# Altium schematic sheet interfaces_module.SchDoc
size A4
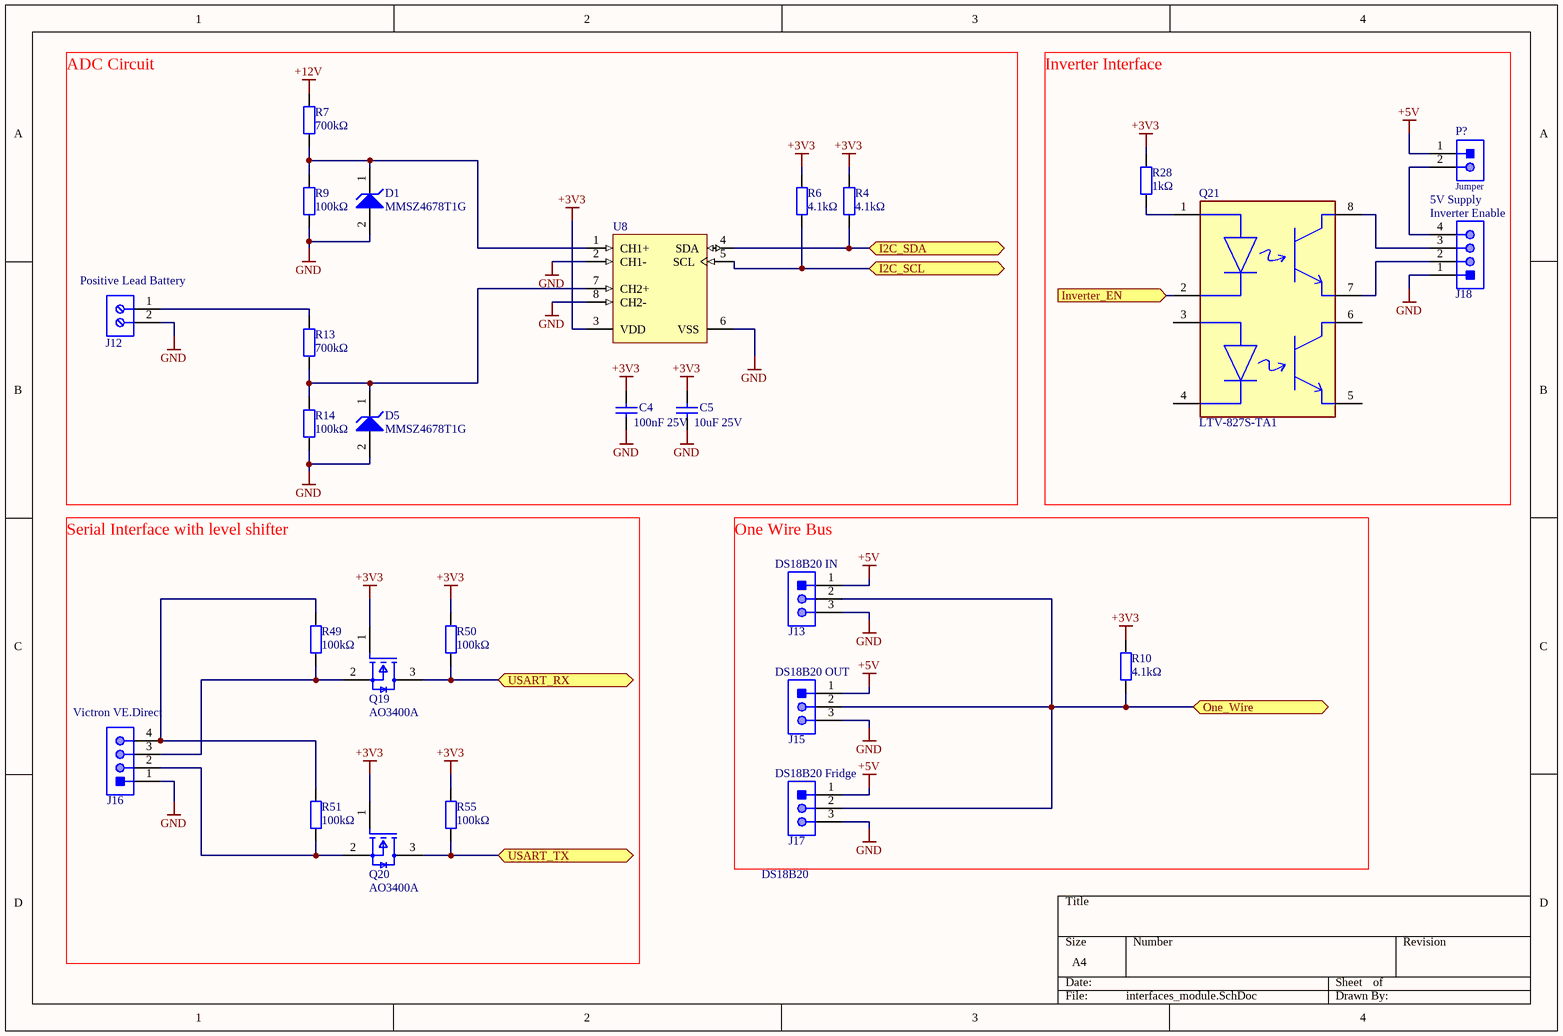
[diagram p0: interfaces_module.SchDoc]

## Parts
C4  100nF 25V  [CAPC2013X88X50ML20T25]
C5  10uF 25V  [CAPC2013X88X50ML20T25]
D1  MMSZ4678T1G  [ONSC-SOD-123-2-425-04_V]
D5  MMSZ4678T1G  [ONSC-SOD-123-2-425-04_V]
J12  282836-2  [TECO-282836-2_V]  (value not drawn)
J13  JST-S3B-PH-SM4-TB-3_V  [JST-S3B-PH-SM4-TB-3_V]  (value not drawn)
J15  JST-S3B-PH-SM4-TB-3_V  [JST-S3B-PH-SM4-TB-3_V]  (value not drawn)
J16  JST-S4B-PH-SM4-TB-3_V  [JST-S4B-PH-SM4-TB-3_V]  (value not drawn)
J17  JST-S3B-PH-SM4-TB-3_V  [JST-S3B-PH-SM4-TB-3_V]  (value not drawn)
J18  JST-S4B-PH-SM4-TB-3_V  [JST-S4B-PH-SM4-TB-3_V]  (value not drawn)
P?  Jumper  [61300211121]
Q19  AO3400A  [SOT-23]
Q20  AO3400A  [SOT-23]
Q21  LTV-827S-TA1  [FP-LTV-827S-TA1-MFG]
R4  4.1kΩ  [RESC2013X50X30ML20T20]
R6  4.1kΩ  [RESC2013X50X30ML20T20]
R7  700kΩ  [RESC2013X50X30ML20T20]
R9  100kΩ  [RESC2013X50X30ML20T20]
R10  4.1kΩ  [RESC2013X50X30ML20T20]
R13  700kΩ  [RESC2013X50X30ML20T20]
R14  100kΩ  [RESC2013X50X30ML20T20]
R28  1kΩ  [RESC2013X50X30ML20T20]
R49  100kΩ  [RESC2013X50X30ML20T20]
R50  100kΩ  [RESC2013X50X30ML20T20]
R51  100kΩ  [RESC2013X50X30ML20T20]
R55  100kΩ  [RESC2013X50X30ML20T20]
U8  (no value)  [SOIC-SN8_L]

## Ports
I2C_SCL (bidir), I2C_SDA (bidir), Inverter_EN (in), One_Wire (bidir), USART_RX (bidir), USART_TX (bidir)

## Nets
+3V3: C4.2 C5.2 Q19.1(G) Q20.1(G) R4.2 R6.2 R10.2 R28.1 R50.1 R55.1 U8.3(VDD)
+5V: J13.1 J15.1 J17.1 P?.1
+12V: R7.1
GND: C4.1 C5.1 D1.2(A) D5.2(A) J12.2 J13.3 J15.3 J16.1 J17.3 J18.1 R9.1 R14.1 U8.2(CH1-) U8.6(VSS) U8.8(CH2-)
I2C_SCL: R6.1 U8.5(SCL) ; port I2C_SCL
I2C_SDA: R4.1 U8.4(SDA) ; port I2C_SDA
Inverter_EN: Q21.2(1_Cathode) ; port Inverter_EN
One_Wire: J13.2 J15.2 J17.2 R10.1 ; port One_Wire
USART_RX: Q19.3(D) R50.2 ; port USART_RX
USART_TX: Q20.3(D) R55.2 ; port USART_TX
NetD1_1: D1.1(K) R7.2 R9.2 U8.1(CH1+)
NetD5_1: D5.1(K) R13.2 R14.2 U8.7(CH2+)
NetJ12_1: J12.1 R13.1
NetJ16_2: J16.2 Q20.2(S) R51.2
NetJ16_3: J16.3 Q19.2(S) R49.2
NetJ16_4: J16.4 R49.1 R51.1
NetJ18_2: J18.2 Q21.7(E)
NetJ18_3: J18.3 Q21.8(C)
NetJ18_4: J18.4 P?.2
NetQ21_1: Q21.1(1_Anode) R28.2

Not connected (* = marked no-connect by the designer): Q21 3(2_Anode) 4(2_Cathode) 5(E) 6(C)

## Notes on the sheet
- 5V Supply
- (near J18) Inverter Enable
- (near J12) Positive Lead Battery
- ADC Circuit
- Inverter Interface
- (near J13) DS18B20 IN
- (near J16) Victron VE.Direct
- (near J15) DS18B20 OUT
- (near J17) DS18B20 Fridge
- One Wire Bus
- (near J17) DS18B20
- Serial Interface with level shifter

## Library data of the parts
C4 C5 = Cap_0805: Capacitor
D1 D5 = CMP-1060-00511-1: Zener Voltage Regulator, 500 mW, 2-Pin SOD-123, Pb-Free, Tape and Reel; Manufacturer: On Semiconductor; P Max (W): 0.5; VZ Typ (V): 1.8; PackageDescription: 2-Pin SOD, Body 1.6 x 2.69 mm; ComponentLink3Description: Package Specification; PackageReference: SOD-123-2-425-04; RoHS: Pb-Free; PackageVersion: Rev. G, 10/2009; Packing: Tape and Reel; ComponentLink1URL: http://www.onsemi.com/; ComponentLink2Description: Datasheet; ComponentLink3URL: http://www.onsemi.com/pub_link/Collateral/425-04.PDF; ComponentLink2URL: http://www.onsemi.com/pub_link/Collateral/MMSZ4678T1-D.PDF; DatasheetVersion: Rev. 9; ComponentLink1Description: Manufacturer URL; Mounting Technology: Surface Mount; PartNumber: MMSZ4678T1G
J12 = CMP-1684-00017-1: Female Header, Pitch 5 mm, 1 x 2 Position, Height 10 mm, Tail Length 3.5 mm, Rohs, Bulk; Manufacturer: TE Connectivity; Wire Gauge: 16-30AWG; Product Training Modules: Wire-to-BoardEurostyleTerminalBlocks; Clamp Material - Plating: Brass-NickelPlated; Voltage: 300V; Mating Orientation: HorizontalwithBoard; Current: 13.5A; Pitch: 0.197"(5.00mm); Screw Thread: M3; 3D Model: 282836-2.pdf; Other Names: 5ULV-02B / A98076; Dynamic Catalog: BuchananSeries; Number of Levels: 1; Torque - Screw: 0.68Nm(6Lb-In); Featured Product: EurostyleTerminalBlockConnectors; Positions Per Level: 2; Wire Termination: Screw-RisingCageClamp; Datasheet URL: http://www.te.com.cn/commerce/DocumentDelivery/DDEController?Action=showdoc&DocId=Catalog+Section%7F1308389_EUROSTYLE_TERMINAL_BLOCKS%7F0607%7Fpdf%7FEnglish%7FENG_CS_1308389_EUROSTYLE_TERMINAL_BLOCKS_0607.pdf%7F282836-2; Color: Green; Family: TerminalBlocks-WiretoBoard; RoHS Information: 282836-2StatementofCompliance; Standard Package: 300; Contact Material - Plating: Brass-TinPlated; Manufacturer URL: http://www.te.com; Housing Material: Polyamide(PA66),Nylon6/6; Features: Interlocking(Side); Package Description: Female Header, Pitch 5 mm, 1 x 2 Position, Height 10 mm, Tail Length 3.5 mm; Mounting Type: ThroughHole; Package Reference: THD; Packaging: Bulk; Series: Buchanan; Category: Connectors,Interconnects; Screw Material - Plating: Brass-NickelPlated
J13 J15 J17 = CONNECTOR_JST-S3B-PH-SM4
J16 J18 = CONNECTOR_JST-S4B-PH-SM4
P? = CMP-1712-00002-4: THT Vertical Pin Header WR-PHD, Pitch 2.54 mm, Single Row, 2 pins; Manufacturer: Wurth Elektronik; Rated Current: 3A; Gender: Male; Withstanding Voltage: 500VAC; Working Voltage: 250VAC; Pitch: 2.54mm; Contact Resistance: 20mOhm; Pin Number: 2; Mounting Technology: THT; Orientation: Vertical; Operating Temperature: -40to105degC; Packaging: Bag; Publisher: WurthElektronik; Datasheet URL: https://katalog.we-online.de/em/datasheet/6130xx11121.pdf; Manufacturer URL: http://www.we-online.de; Row Number: Single; Package Reference: 61300211121; Part Number: 61300211121
Q19 Q20 = MOSFET_AO3400A: MOSFET N-CH 30V 5.7A SOT23; Input Capacitance: 630pF; Number of Elements: 1; Rds On Max: 26.5mR; Max Power Dissipation: 1.4W; Gate to Source Voltage (Vgs): 12V; Min Operating Temperature: -55°C; Lead Free: Lead Free; Number of Pins: 3; Drain to Source Voltage (Vdss): 30V; Case/Package: SOT-23; Mount: Surface Mount; Continuous Drain Current (ID): 5.7A; Radiation Hardening: No; Packaging: Tape and Reel; Max Operating Temperature: 150°C; Power Dissipation: 1.4W
Q21 = CMP-22018-000005-1: OPTOISOLATOR 5KV 2CH TRANS 8-SMD; Number of Channels: 2; Forward Current: 50mA; Reverse Breakdown Voltage: 6V; Current Transfer Ratio: 600%; Collector Emitter Saturation Voltage: 200mV; Collector Emitter Voltage (VCEO): 35V; Max Power Dissipation: 200mW; Rise Time: 18000ns; Forward Voltage: 1.4V; Number of Elements: 2; Min Operating Temperature: -30°C; Number of Circuits: 2; Max Collector Current: 50mA; Packaging: Tape and Reel; Max Input Current: 50mA; Case/Package: SMD/SMT; Radiation Hardening: No; Package Quantity: 1000; Max Output Voltage: 35V; Output Current per Channel: 50mA; Fall Time: 18000ns; Mount: Surface Mount; Isolation Voltage: 5kV; Power Dissipation: 200mW; Lead Free: Lead Free; Max Operating Temperature: 110°C; Output Voltage: 35V; Number of Pins: 8
R4 R6 R7 R9 R10 R13 R14 R28 R49-R51 R55 = Res_0805: Resistor
U8 = CMP-0188-01151-1: 16-Bit, Multi-Channel Delta-Sigma Analog-to-Digital Converter with I2C Interface and On-Board Reference, 8-Pin SOIC 150mil, Extended Temperature; ComponentLink2Description: Datasheet; ComponentLink3Description: Package Specification; PackageVersion: revBB, Aug-2009; Code_JEDEC: MS-012; Code_IPC: SOIC127P600-8; PackageDescription: 8-Lead Plastic Small Outline (SN) - Narrow, 3.90mm Body [SOIC]; ComponentLink1Description: Manufacturer URL; ComponentLink2URL: http://ww1.microchip.com/downloads/en/DeviceDoc/22226a.pdf; ComponentLink1URL: http://www.microchip.com/; DatasheetVersion: revA, Dec-2009; ComponentLink3URL: http://www.microchip.com/stellent/groups/techpub_sg/documents/packagingspec/en012702.pdf; PackageReference: SOIC-SN8